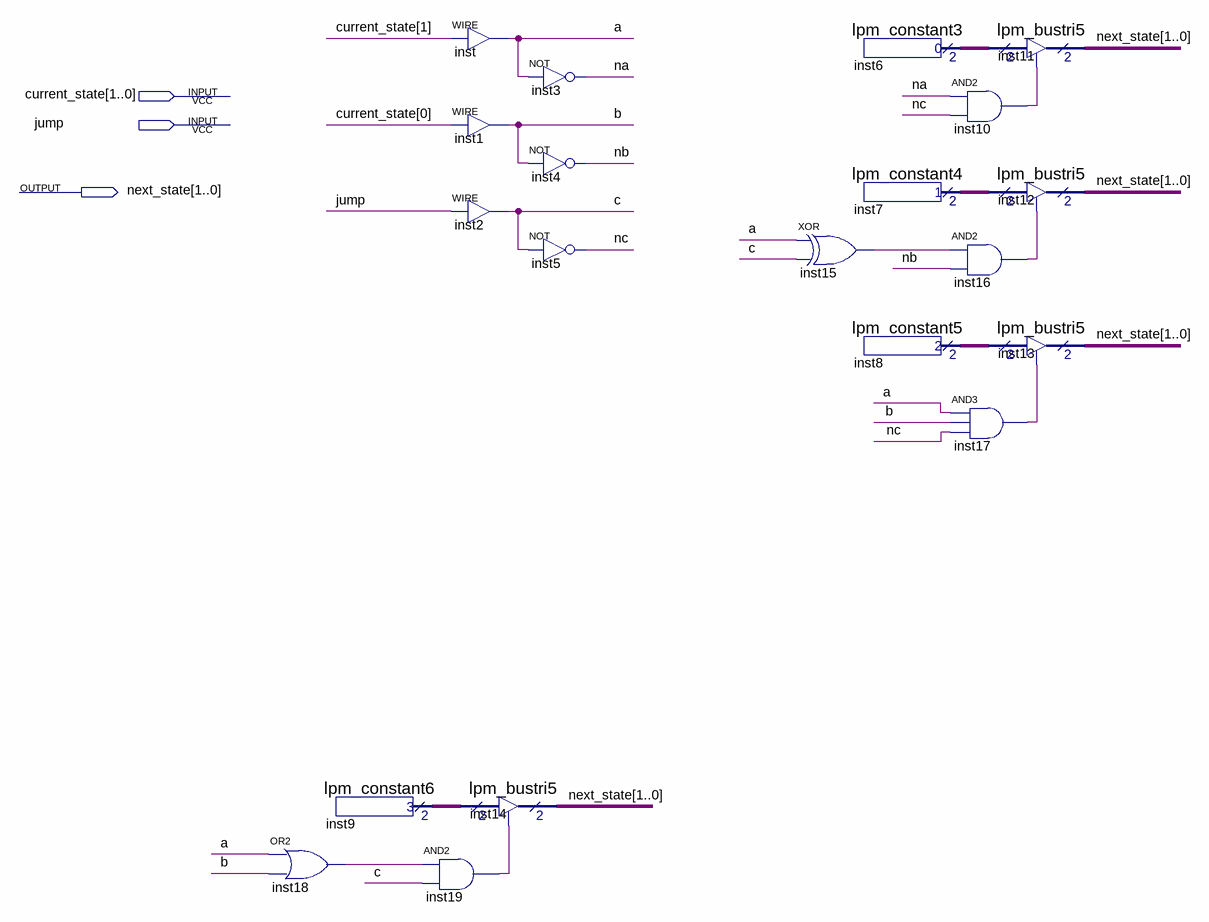
[diagram p0: schematic sheet]
// Quartus schematic AutomatA5.bdf as structural Verilog: 20 symbols, 3 pins
module AutomatA5 (
  input  [1:0] current_state,
  input  jump,
  output [1:0] next_state
);

  wire a, b, c, inst10_out, inst15_out, inst16_out, inst17_out, inst18_out, inst19_out, na, nb, nc;
  wire [1:0] inst6_result, inst7_result, inst8_result, inst9_result;

  or inst18 (inst18_out, a, b);
  lpm_constant6 inst9 (.result(inst9_result));
  and inst19 (inst19_out, inst18_out, c);
  assign a = current_state[1];  // WIRE inst
  assign b = current_state[0];  // WIRE inst1
  assign c = jump;  // WIRE inst2
  lpm_bustri5 inst14 (.enabledt(inst19_out), .data(inst9_result), .tridata(next_state));
  not inst3 (na, a);
  not inst4 (nb, b);
  not inst5 (nc, c);
  xor inst15 (inst15_out, a, c);
  lpm_constant3 inst6 (.result(inst6_result));
  lpm_constant4 inst7 (.result(inst7_result));
  lpm_constant5 inst8 (.result(inst8_result));
  and inst10 (inst10_out, na, nc);
  and inst16 (inst16_out, inst15_out, nb);
  and inst17 (inst17_out, a, b, nc);
  lpm_bustri5 inst11 (.enabledt(inst10_out), .data(inst6_result), .tridata(next_state));
  lpm_bustri5 inst12 (.enabledt(inst16_out), .data(inst7_result), .tridata(next_state));
  lpm_bustri5 inst13 (.enabledt(inst17_out), .data(inst8_result), .tridata(next_state));
endmodule
